# EAGLE design otternet_v2a_cc1101 (EAGLE 7.5.0)
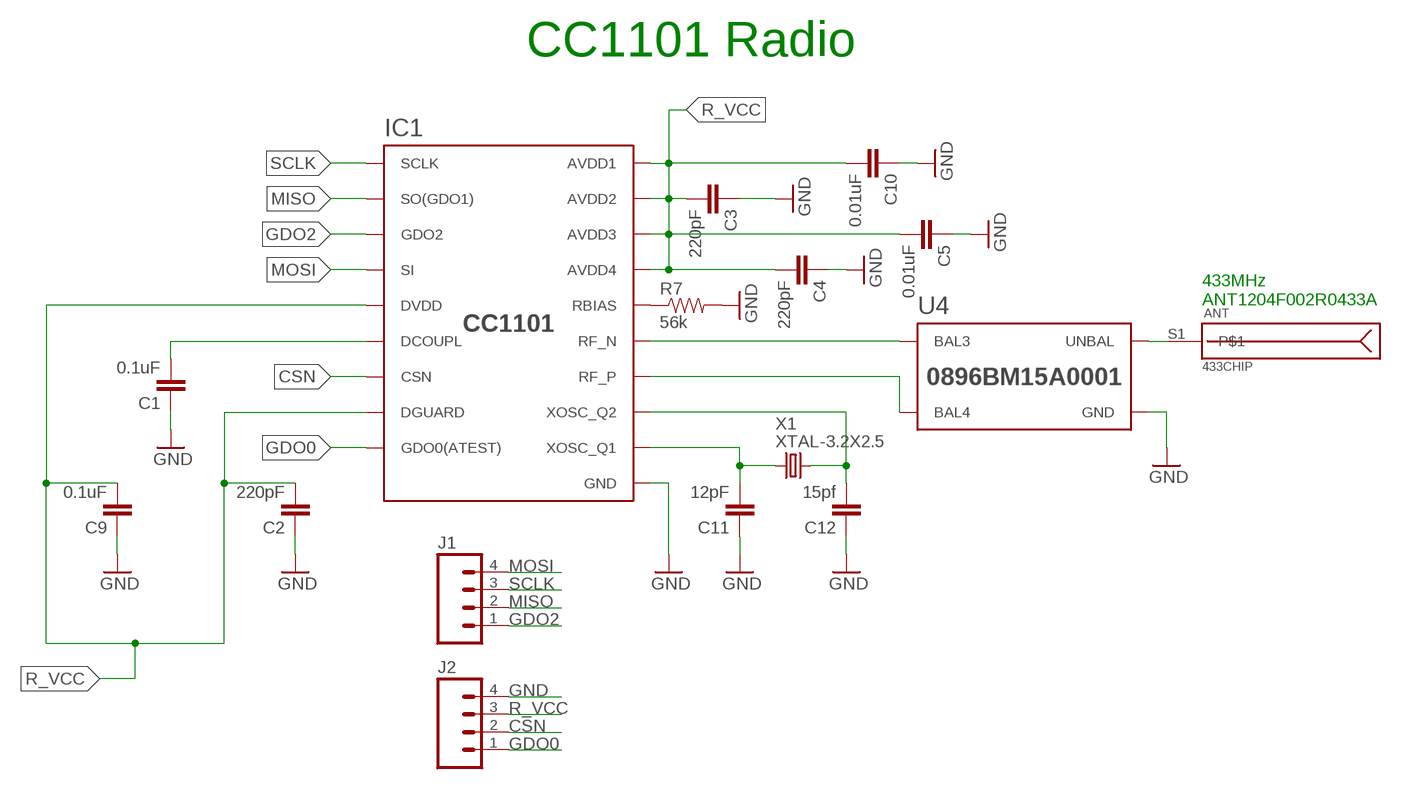
[diagram p0: schematic, sheet 1]

## Parts
ANT  433CHIP  [ANT-433-USP]
C1  0.1uF  C-EU  [0402]
C2  220pF  C-EU  [0402]
C3  220pF  C-EU  [0402]
C4  220pF  C-EU  [0402]
C5  0.01uF  C-EU  [0402]
C9  0.1uF  C-EU  [0402]
C10  0.01uF  C-EU  [0402]
C11  12pF  C-EU  [0402]
C12  15pf  C-EU  [0402]
IC1  CC1101  [QLP20]
J1  M04PTH  [1X04]
J2  M04PTH  [1X04]
R7  56k  R-EU  [0402]
U4  0896BM15A0001  [XXXXBM15A0001]
X1  XTAL-3.2X2.5  [XTAL-3.2X2.5]

## Nets
CSN: IC1.7(CSN) J2.2
GDO0: IC1.6(GDO0(ATEST)) J2.1
GDO2: IC1.3(GDO2) J1.1
GND: C1.1 C2.1 C3.1 C4.1 C5.1 C9.1 C10.1 C11.1 C12.1 IC1.16(GND) IC1.19(GND) IC1.GND IC1.GND1(GND) IC1.GND2(GND) IC1.GND3(GND) IC1.GND4(GND) IC1.GND5(GND) J2.4 R7.2 U4.2(GND) U4.5(GND) U4.6(GND)
MISO: IC1.2(SO(GDO1)) J1.2
MOSI: IC1.20(SI) J1.4
N$1: IC1.17(RBIAS) R7.1
N$2: C12.2 IC1.10(XOSC_Q2) X1.3
N$3: IC1.12(RF_P) U4.4(BAL4)
N$4: C1.2 IC1.5(DCOUPL)
N$5: IC1.13(RF_N) U4.3(BAL3)
N$7: C11.2 IC1.8(XOSC_Q1) X1.1
N$9: ANT.S1 U4.1(UNBAL)
R_VCC: C2.2 C3.2 C4.2 C5.2 C9.2 C10.2 IC1.4(DVDD) IC1.9(AVDD1) IC1.11(AVDD2) IC1.14(AVDD3) IC1.15(AVDD4) IC1.18(DGUARD) J2.3
SCLK: IC1.1(SCLK) J1.3

## Notes on the sheet
- CC1101 Radio
- 433MHz
  ANT1204F002R0433A

## Library data of the parts
ANT = HF-Bauteile:433CHIP; MOUSER: 603-ANT1204F002R0433
C1 C9 = tiny_passives:C-EU; MOUSER: 581-530L104KT16T
C2-C4 = tiny_passives:C-EU; MOUSER: 605-500X07W221MV4T
C5 C10 = tiny_passives:C-EU; MOUSER: 80-C0402T103K5RCL
C11 = tiny_passives:C-EU; MOUSER: 581-04025U120FAT2A
C12 = tiny_passives:C-EU; MOUSER: 80-CBR04C150F1GAC
IC1 = cc1101:CC1101; DIGIKEY: 296-35718-1-ND; MOUSER: 595-CC1101RGPR
J1 J2 = SparkFun-Connectors:M04: Header 4 Standard 4-pin 0.1" header. Use with straight break away headers (SKU : PRT-00116), right angle break away headers (PRT-00553), swiss pins (PRT-00743), machine pins (PRT-00117), and female headers (PRT-00115). Molex polarized connector foot print use with SKU : PRT-08231 with associated crimp pins and housings. 1MM SMD Version SKU: PRT-10208; PROD_ID: CONN-09696
R7 = tiny_passives:R-EU; DIGIKEY: 311-56KJRCT-ND; MOUSER: 603-RC0402JR-0756KL
U4 = johanson-baluns:0896BM15A0001: 868/915 MHz Impedance Matched/Balun/LPF Integrated Component for T.I. CC110X, CC111X, CC113X and CC115X, CC110L, CC113L, CC115L, CC430 and RF430; MOUSER: 609-0433BM15A0001E
X1 = cc1101:XTAL; DIGIKEY: 644-1261-1-ND

## Board
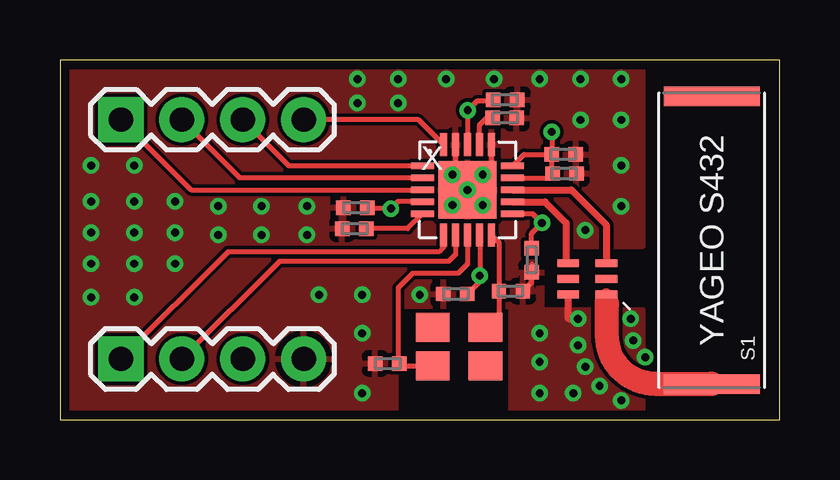
[diagram p1: board, top side]
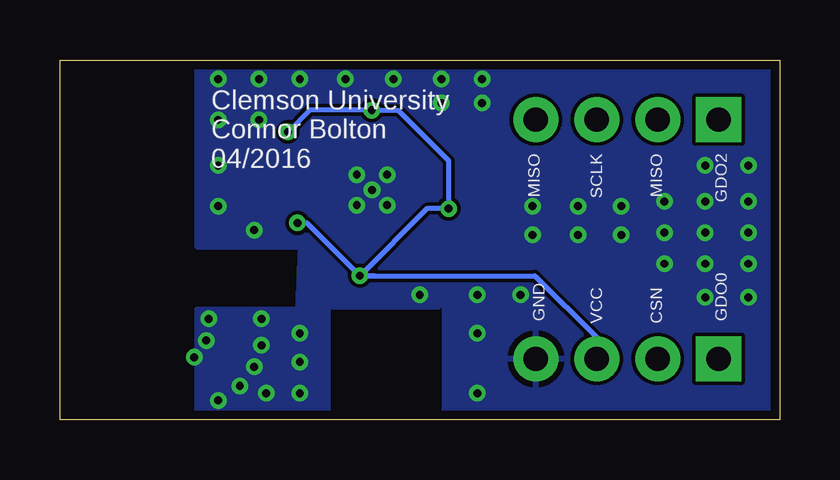
[diagram p2: board, bottom side, seen from below]

Size 30 x 15 mm. Coordinates in mm from the lower left corner, seen from the top.
Outline: 0,0 30,0 30,15 0,15 0,0
Copper layers (1*16): Top 0.0356mm / dielectric 1.5011mm / Bottom 0.0356mm
Design rules "LaenPCBOrder": minimum track width 6mil, minimum drill 13mil, track to track 6mil, track to pad 6mil, pad to pad 6mil, via to via 6mil, smd to smd 6mil, copper to edge 15mil, drill to drill 6mil, minimum pad ring 7mil, minimum via ring 7mil, stop-mask expansion 3mil, vias tented up to drill 0mil, thermal gap 10mil

### Footprints (pad centres in the part's own frame; a part is rotated, then mirrored left to right if it is on the bottom)
ANT-433-USP = smd 0.8 x 4: P$4 6,0; S1 -6,0
0402 = smd 0.6 x 0.6: 1 -0.49,0; 2 0.51,0
QLP20 = smd 0.96 x 0.28: 1 -1.88,1; 2 -1.88,0.5; 3 -1.88,0; 4 -1.88,-0.5; 5 -1.88,-1; 11 1.88,-1; 12 1.88,-0.5; 13 1.88,0; 14 1.88,0.5; 15 1.88,1 | smd 0.28 x 0.96: 6 -1,-1.88; 7 -0.5,-1.88; 8 0,-1.88; 9 0.5,-1.88; 10 1,-1.88; 16 1,1.88; 17 0.5,1.88; 18 0,1.88; 19 -0.5,1.88; 20 -1,1.88 | smd 2.4 x 2.4: GND 0,0 | drill 0.333: GND1 0,0; GND2 -0.635,0.635; GND3 0.635,0.635; GND4 -0.635,-0.635; GND5 0.635,-0.635
1X04 = drill 1.016 pad 1.88 square: 1 0,0 | drill 1.016 pad 1.88: 2 2.54,0; 3 5.08,0; 4 7.62,0
XXXXBM15A0001 = smd 0.33 x 0.9: 1 0.65,0.8; 2 0,0.8; 3 -0.65,0.8; 4 -0.65,-0.8; 5 0,-0.8; 6 0.65,-0.8
XTAL-3.2X2.5 = smd 1.4 x 1.2: 1 -1.1,-0.8; 2 1.1,-0.8; 3 1.1,0.8; 4 -1.1,0.8

### Placement (x,y rotation side)
ANT  27.17,7.48 90 top
C1  12.26,7.96 0 top
C2  18.58,13.34 180 top
C3  19.66,6.63 90 top
C4  21.01,11.06 180 top
C5  21.05,10.26 180 top
C9  12.31,8.84 0 top
C10  16.47,5.24 0 top
C11  13.63,2.34 0 top
C12  18.81,5.36 180 top
IC1  16.99,9.58 0 top
J1  2.54,12.51 0 top
J2  2.54,2.53 0 top
R7  18.53,12.58 0 top
U4  21.98,5.87 270 top
X1  16.64,3.04 0 top

### Tracks (layer width: path | path; a pad name or v marks a point on that pad's centre or on a via)
CSN
  Top 0.2: IC1.7 16.49,6.89 16.2,6.6 9.15,6.6 J2.2
GDO0
  Top 0.2: IC1.6 15.99,7.19 15.8,7 7.01,7 J2.1
GDO2
  Top 0.2: J1.1 5.47,9.58 IC1.3
GND  (via drill 0.33)
  Top 0.2: IC1.16 17.99,10.58 IC1.GND3 IC1.GND1 | IC1.19 16.49,10.35 IC1.GND2 IC1.GND1 | IC1.GND5 IC1.GND1 | IC1.GND4 IC1.GND1 | 19.69,6.47 C3.1 19.66,5.72 C12.1
  Top 0.3: U4.6 21.18,4.22 v21.6,4.2
  other vias: 21.6,3.1 21.9,2.2 22.5,1.4 23.9,3.3 23.8,4.2 15,5.2 10.3,8.9 10.8,5.2 24.4,2.6 23.4,0.8 23.4,10.6 23.4,12.5 23.4,14.2 21.7,14.2 21.7,12.5 20,14.2 18.1,14.2 16.1,14.2 14.1,14.2 14.1,13.2 12.4,13.2 12.4,14.2 10.3,7.7 8.4,7.7 6.6,7.7 4.8,7.8 3.1,7.8 1.3,7.8 8.4,8.9 6.6,8.9 4.8,9.1 3.1,9.1 1.3,9.1 1.3,10.6 3.1,10.6 1.3,6.5 1.3,5.1 3.1,6.5 3.1,5.1 4.8,6.5 12.6,5.2 12.6,3.6 12.6,1.1 20,3.6 20,2.4 20,1.1 21.4,1.1 23.4,8.9 21.9,7.9
  pour Top: -0.7,15.5 24.3,15.6 24.3,7.2 20.1,7.2 20.1,4.6 24.3,4.6 24.3,-0.7 18.8,-0.7 18.8,4.7 14,4.7 14,-0.5 -0.7,-0.8
  pour Bottom: -0.3,15.1 24.3,15.3 24.3,7.2 20,7.2 20.1,4.6 24.3,4.6 24.3,-0.1 18.8,-0.1 18.8,4.7 14.2,4.7 14.2,4.8 14,4.8 14,-0.3 -0.3,-0.3
MISO
  Top 0.2: IC1.2 7.51,10.08 J1.2
MOSI
  Top 0.2: IC1.20 14.94,12.51 J1.4
N$1
  Top 0.2: IC1.17 17.49,12.29 17.78,12.58 R7.1
N$2
  Top 0.2: IC1.10 18.3,7.39 C12.2 18.3,4.4 X1.3 17.74,4.3
N$3
  Top 0.3: IC1.12 20.22,9.08 21.1,8.2 21.1,6.6 U4.4
N$4
  Top 0.2: IC1.5 14.49,7.96 C1.2
N$5
  Top 0.3: IC1.13 21.32,9.58 22.78,8.12 U4.3
N$7
  Top 0.2: X1.1 14.24,2.24 C11.2 14.1,2.38 14.1,5.5 14.7,6.1 16.6,6.1 16.99,6.49 IC1.8
N$9
  Top 0.5: U4.1 22.78,4.92 22.8,4.9
  Top 1: ANT.S1 arc90 27.15,1.5 24.8,1.5 arc-90 22.8,3.5 22.8,4.6 22.8,4.7 22.8,4.9
R_VCC  (via drill 0.33)
  Top 0.2: C2.2 18.03,13.3 17.4,13.3 v17,12.9 IC1.18 | IC1.9 17.46,7.67 17.5,7.63 v17.5,6 | v17.5,6 17.48,5.98 | IC1.4 15.09,9.1 14.1,9.1 v13.8,8.8 12.86,8.8 C9.2 12.98,9 | v17.5,6 17.5,5.76 C10.2 | C3.2 19.66,7.76 v20.1,8.2 19.72,8.58 IC1.11 | v20.5,12 C4.2 | C4.2 20.5,10.3 C5.2 20.36,10.08 IC1.14 | IC1.15 19.35,11.06 C4.2
  Bottom 0.2: v20.5,12 19.6,12.9 v17,12.9 15.9,12.9 13.8,10.8 v13.8,8.8 14.7,8.8 v17.5,6 | 16.9,6 v17.5,6 | v20.1,8.2 19.7,8.2 v17.5,6 | v17.5,6 10.2,6 7.62,3.42 J2.3
SCLK
  Top 0.2: IC1.1 9.55,10.58 J1.3

### Text on the board
tPlace: X
bPlace: GDO2 | MISO | SCLK | MISO | Clemson University / Connor Bolton / 04/2016 | GDO0 | CSN | VCC | GND